# EAGLE design GPSN v1 (EAGLE 9.5.0)
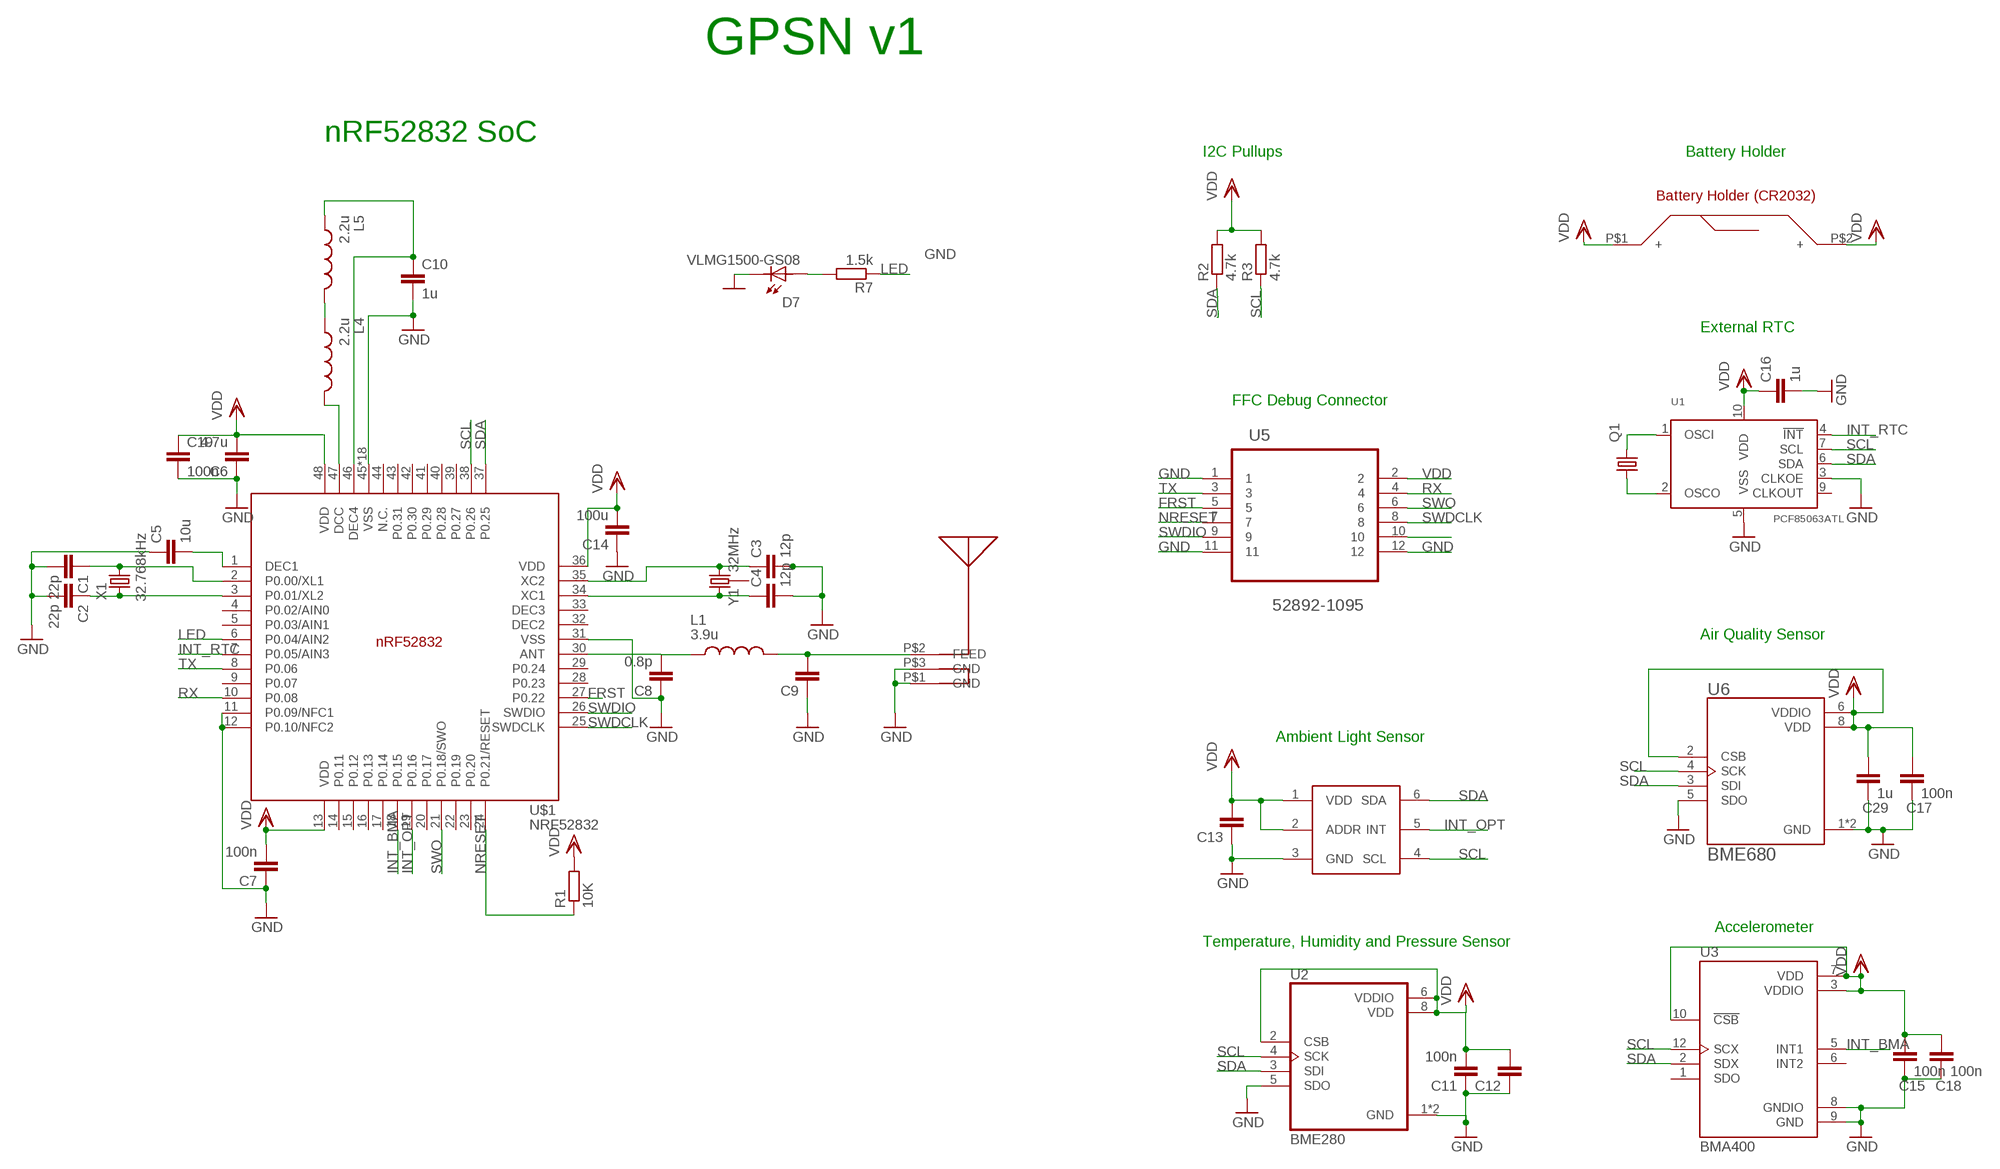
[diagram p0: schematic, sheet 1]

## Parts
C1  22p  CC0402  [C0402]
C2  22p  CC0402  [C0402]
C3  12p  CC0402  [C0402]
C4  12p  CC0402  [C0402]
C5  10u  CC0402  [C0402]
C6  4.7u  CC0402  [C0402]
C7  100n  CC0603R  [C0603R]
C8  0.8p  CC0402  [C0402]
C9  1.2p  CC0402  [C0402]
C10  1u  CC0402  [C0402]
C11  100n  CC0402  [C0402]
C12  1u  CC0402  [C0402]
C13  100n  CC0402  [C0402]
C14  100u  CC0402  [C0402]
C15  100n  CC0402  [C0402]
C16  1u  CC0603R  [C0603R]
C17  100n  CC0402  [C0402]
C18  100n  CC0402  [C0402]
C19  100n  CC0402  [C0402]
C29  1u  CC0402  [C0402]
D7  VLMG1500-GS08  [LEDC1005X35N]
L1  3.9u  MHQ0402P7N5JT000  [INDC0402X26N]
L4  2.2u  MHQ0402P7N5JT000  [INDC0402X26N]
L5  2.2u  MHQ0402P7N5JT000  [INDC0402X26N]
Q1  KX-327-RT  [2.0X1.2]
R1  10K  RR0402  [R0402]
R2  4.7k  RR0402  [R0402]
R3  4.7k  RR0402  [R0402]
R7  1.5k  RR0402  [R0402]
U1  PCF85063ATL  [SOT1197-1]
U2  BME280  [PSON65P250X250X100-8N]
U3  BMA400  [XDCR_BMA400]
U5  52892-1095  [MOLEX_52892-1095]
U6  BME680  [PSON80P300X300X100-8N]
U$1  NRF52832  [QFN40P600X600X90-48_N]
U$2  HOLDER  [HOLDER]
U$3  TI-OPT3001  [TI-OPT3001]
U$4  CHIPANTENNAL2  [CHIPANTENNAL2]
X1  32.768kHz  ABS07-32.768KHZ-T  [ABS07-32.768KHZ-T]
Y1  32MHz  CRYSTAL-26MHZSMD-3.2X2.5  [CRYSTAL-SMD-3.2X2.5MM]

## Nets
FRST: U5.5 U$1.27(P0.22)
GND: C1.2 C2.2 C3.2 C4.2 C5.1 C6.1 C7.1 C8.1 C9.1 C10.2 C11.1 C12.1 C13.1 C14.1 C15.2 C16.2 C17.2 C18.2 C19.2 C29.2 D7.2 U1.3(CLKOE) U1.5(VSS) U2.1(GND) U2.5(SDO) U2.7(GND) U3.8(GNDIO) U3.9(GND) U5.1 U5.11 U5.12 U6.1(GND) U6.5(SDO) U6.7(GND) U$1.11(P0.09/NFC1) U$1.12(P0.10/NFC2) U$1.31(VSS) U$1.45(VSS) U$1.PAD(VSS) U$1.PAD@VIA01(VSS) U$1.PAD@VIA02(VSS) U$1.PAD@VIA03(VSS) U$1.PAD@VIA04(VSS) U$1.PAD@VIA05(VSS) U$1.PAD@VIA06(VSS) U$1.PAD@VIA07(VSS) U$1.PAD@VIA08(VSS) U$1.PAD@VIA09(VSS) U$1.PAD@VIA10(VSS) U$1.PAD@VIA11(VSS) U$1.PAD@VIA12(VSS) U$1.PAD@VIA13(VSS) U$1.PAD@VIA14(VSS) U$1.PAD@VIA15(VSS) U$1.PAD@VIA16(VSS) U$3.3(GND) U$4.P$1(GND) U$4.P$3(GND)
INT_BMA: U3.5(INT1) U$1.18(P0.15)
INT_OPT: U$1.19(P0.16) U$3.5(INT)
INT_RTC: U1.4(!INT!) U$1.7(P0.05/AIN3)
LED: R7.1 U$1.6(P0.04/AIN2)
N$1: C1.1 U$1.2(P0.00/XL1) X1.2
N$2: C2.1 U$1.3(P0.01/XL2) X1.1
N$3: C3.1 U$1.35(XC2) Y1.3
N$4: C4.1 U$1.34(XC1) Y1.1
N$5: C5.2 U$1.1(DEC1)
N$6: C8.2 L1.1 U$1.30(ANT)
N$7: Q1.2 U1.1(OSCI)
N$8: Q1.1 U1.2(OSCO)
N$9: L4.2 U$1.47(DCC)
N$10: L4.1 L5.2
N$11: C10.1 L5.1 U$1.46(DEC4)
N$19: D7.1 R7.2
N$21: U5.10
NRESET: R1.1 U5.7 U$1.24(P0.21/RESET)
RF: C9.2 L1.2 U$4.P$2(FEED)
RX: U5.4 U$1.10(P0.08)
SCL: R3.1 U1.7(SCL) U2.4(SCK) U3.12(SCX) U6.4(SCK) U$1.38(P0.26) U$3.4(SCL)
SDA: R2.1 U1.6(SDA) U2.3(SDI) U3.2(SDX) U6.3(SDI) U$1.37(P0.25) U$3.6(SDA)
SWDCLK: U5.8 U$1.25(SWDCLK)
SWDIO: U5.9 U$1.26(SWDIO)
SWO: U5.6 U$1.21(P0.18/SWO)
TX: U5.3 U$1.8(P0.06)
VDD: C6.2 C7.2 C11.2 C12.2 C13.2 C14.2 C15.1 C16.1 C17.1 C18.1 C19.1 C29.1 R1.2 R2.2 R3.2 U1.10(VDD) U2.2(CSB) U2.6(VDDIO) U2.8(VDD) U3.3(VDDIO) U3.7(VDD) U3.10(!CSB) U5.2 U6.2(CSB) U6.6(VDDIO) U6.8(VDD) U$1.13(VDD) U$1.36(VDD) U$1.48(VDD) U$2.P$1(+) U$2.P$2(+) U$3.1(VDD) U$3.2(ADDR)
Unconnected: U1.9(CLKOUT) U3.1(SDO) U3.6(INT2) U$1.4(P0.02/AIN0) U$1.5(P0.03/AIN1) U$1.9(P0.07) U$1.14(P0.11) U$1.15(P0.12) U$1.16(P0.13) U$1.17(P0.14) U$1.20(P0.17) U$1.22(P0.19) U$1.23(P0.20) U$1.28(P0.23) U$1.29(P0.24) U$1.32(DEC2) U$1.33(DEC3) U$1.39(P0.27) U$1.40(P0.28) U$1.41(P0.29) U$1.42(P0.30) U$1.43(P0.31) U$1.44(N.C.) Y1.2 Y1.4

## Notes on the sheet
- GPSN v1
- nRF52832 SoC
- I2C Pullups | Battery Holder
- External RTC
- FFC Debug Connector
- Air Quality Sensor
- Ambient Light Sensor
- Accelerometer
- Temperature, Humidity and Pressure Sensor

## Library data of the parts
C1-C6 C8-C15 C17-C19 C29 = eagle-ltspice:C: CAPACITOR, European symbol; SPICEMODEL: NONE; SPICEPREFIX: C
C7 C16 = eagle-ltspice:C: CAPACITOR, European symbol
D7 = VLMG1500-GS08:VLMG1500-GS08: 0402 GREEN 571nm 35MCD 65° Rectangle with Flat Top SMT LED; AVAILABILITY: Unavailable; DESCRIPTION: 0402 GREEN 571nm 35MCD 65° Rectangle with Flat Top SMT LED; MF: Vishay; MP: VLMG1500-GS08; PACKAGE: 0402 Vishay; PRICE: None
L1 L4 L5 = MHQ0402P7N5JT000:MHQ0402P7N5JT000: 221 NH 5% GOLD TERMINAL; AVAILABILITY: Unavailable; DESCRIPTION: FIXED IND 7.5NH 200MA 1.2 OHM; MF: TDK; MP: MHQ0402P7N5JT000; PACKAGE: 0402 TDK; PRICE: None
Q1 = crystal-geyer_V1_0:KX-327: Tuning Fork Crystals (kHz) SMD: KX327 - Serie Model Size l/w/h [mm] Frequency Range Frequency Stability Temp. Range [°C] Load Capacitance AECQ 200 availabel Datasheet KX-327VT KX-327FT KX-327RT KX-327NHT KX-327NHF KX-327L KX-327S 1.25/1.05/0.5 1.6/1.0/0.5 2.0/1.2/0.6 3.2/1.5/0.8 3.2/1.5/0.8 7.0/1.5/1.4 8.2/3.8/2.5 32,768 kHz 32,768 kHz 32,768 kHz 32,768 kHz 32,768 kHz 32,768 kHz 32,768 kHz ±10 … ±20ppm ±10 … ±20ppm ±10 … ±20ppm ±10 … ±20ppm ±10 … ±20ppm ±10 … ±20ppm ±5 … ±20ppm (*) -40°C …+85°C (*) -40°C …+85°C (*) -40°C …+85°C (*) -40°C …+85°C (*) -40°C …+125°C (*) -40°C …+85°C (*) -40°C …+85°C 7/9/12,5 7/9/12,5 7/9/12,6 7/9/12,5 9/12,5 7/9/12,5 6/12,5 - - - - yes - - KX-327VT.pdf <http://www.geyer-electronic.de/uploads/tx_userartikelfrequenz/GEYER-KX-327VT.pdf> KX-327FT.pdf <http://www.geyer-electronic.de/uploads/tx_userartikelfrequenz/GEYER-KX-327FT.pdf> KX-327RT.pdf <http://www.geyer-electronic.de/uploads/tx_userartikelfrequenz/GEYER-KX-327RT.pdf> KX-327NHT.pdf <http://www.geyer-electronic.de/uploads/tx_userartikelfrequenz/GEYER-KX-327NHT.pdf> KX-327NHF.pdf <http://www.geyer-electronic.de/uploads/tx_userartikelfrequenz/GEYER-KX-327NHF.pdf> KX-327L.pdf <http://www.geyer-electronic.de/uploads/tx_userartikelfrequenz/GEYER-KX-327L.pdf> KX-327S.pdf <http://www.geyer-electronic.de/uploads/tx_userartikelfrequenz/GEYER-KX-327S.pdf> <http://www.geyer-electronic.de/fileadmin/template/img/logo-geyer-electronic.png> Details see: http://www.geyer-electronic.de/Frequenz-Produkte.9.0.html Created 2016-06-07, Hans Locher 2016 (C) Geyer Quartz Technology KX327VT,KX327FT,KX327RT,KX327NHT,KX327NHF,KX327S,KX327L;125105;1610;2012;3215;7015;8238;1,25x1,05,1.25x1.05;1,6x1,0,1.6x1.0;2,0x1,2,2.0x1.2;3,2x1,5,3.2x1.5;8,2x3,8,8.2x3.8,7.0x1.5,7,0x1,532.768kHz
R1-R3 R7 = eagle-ltspice:R: RESISTOR, European symbol; SPICEMODEL: NONE; SPICEPREFIX: R
U1 = PCF85063ATL:PCF85063ATL: Tiny Real-Time Clock/calendar with alarm function and I2C-bus The PCF85063A is a CMOS1 Real-Time Clock (RTC) and calendar optimized for low power consumption. An offset register allows fine-tuning of the clock. All addresses and data are transferred serially via the two-line bidirectional I2C-bus. Maximum data rate is 400 kbit/s. The register address is incremented automatically after each written or read data byte. AAL Eindhoven MK; AVAILABILITY: Unavailable; DESCRIPTION: Real Time Clock _RTC_ IC Clock/Calendar I²C, 2-Wire Serial 10-XFDFN Exposed Pad; MF: NXP USA; MP: PCF85063ATL; PACKAGE: DFN-10 NXP Semiconductors; PRICE: None
U2 = BME280:BME280: DIGITAL HUMIDITY, PRESSURE AND TEMPERATURE SENSOR * Digital interface I²C (up to 3.4 MHz) and SPI (3 and 4 wire, up to 10 MHz)* Supply voltage VDD main supply voltage range: 1.71 V to 3.6 V*VDDIO interface voltage range: 1.2 V to 3.6 V Operating range -40…+85 °C, 0…100 % rel. humidity, 300…1100 hPa The library has been designed by Richard Magdycz <https://www.facebook.com/groups/eaglecadsoftUK>; AVAILABILITY: Unavailable; DESCRIPTION: Integrated pressure, humidity and temperature sensor; 8-pin 2.5x2.5x0.93mm LGA; MF: Bosch; MP: BME280; PACKAGE: LGA-8 Bosch; PRICE: None
U3 = BMA400:BMA400: Ultra low power, 12-bit digital triaxial accelerometer; AVAILABILITY: Unavailable; DESCRIPTION: Accelerometer X, Y, Z Axis ±2g, 4g, 8g, 16g 12-LGA _2x2_; MF: Bosch Sensortec; MP: BMA400; PACKAGE: LGA-12 Bosch Tools; PRICE: None
U5 = 52892-1095:52892-1095: CONNECTOR, FPC, ZIF, 0.50MM, 10 WAY; AVAILABILITY: Unavailable; DESCRIPTION: Socket, r/a, Fpc, Zif, Smt, 10way; MF: Molex; MP: 52892-1095; PACKAGE: None; PRICE: None
U6 = BME680:BME680: Integrated Environmental Unit; AVAILABILITY: Unavailable; DESCRIPTION: Integrated Environmental Unit; MF: Bosch Sensortec; MP: BME680; PACKAGE: LGA-8 Bosch Tools; PRICE: None
U$1 = Nordic_nRF:NRF52832: nRF52832 Features Single chip, highly flexible, 2.4 GHz multi-protocol SoC 32-bit ARM Cortex-M4F Processor 1.7v to 3.6v operation 512kB flash + 64kB RAM Supports concurrent Bluetooth Smart/ANT protocol operation On-chip NFC tag for Out-of-Band (OOB) pairing Up to +4dBm output power -96dBm sensitivity, Bluetooth Smart Thread safe and run-time protected Event driven API On air compatible with nRF24L and nRF24AP series 2 data rates (2Mbps/1Mbps) PPI - maximum flexibility for power-efficient applications and code simplification Automated power management system with automatic power management of each peripheral Configurable I/O mapping for analog and digital I/O 3 x Master/Slave SPI 2 x Two-wire interface (I²C) UART (RTS/CTS) 3 x PWM AES HW encryption Real Time Counter (RTC) Digital microphone interface (PDM) On-chip balun Applications Internet of Things (IoT) Wearables SmartHome sensors Connected white goods Computer peripherals Voice-command smart remotes A4WP ‘Rezence’ wireless charging Beacons Sports and fitness sensors and hubs Connected health products Smart watches RC Toys Interactive games Building automation and sensor networks
U$2 = batt holder:HOLDER
U$3 = FaBo-Mems:TI-OPT3001
U$4 = CHIPANTENNA:CHIPANTENNAL2
X1 = Crystals:ABS07-32.768KHZ-T: CRYSTAL 32.7680KHZ 12.5PF SMD Manufacturer's datasheet <https://abracon.com/Resonators/ABS07.pdf>; CREATED_BY: PCBLayout.com; DIGIKEY_PART_NUMBER: 535-9542-2-ND; MANUFACTURER: Abracon LLC; MPN: ABS07-32.768KHZ-T; PACKAGE: SMD-2
Y1 = SparkFun-Clocks:CRYSTAL-26MHZ: 26MHz Crystal w/ Ground Pin Digikey Example <http://www.digikey.com/product-detail/en/epson/TSX-3225%2026.0000MF09Z-AC3/SER3627CT-ND/1802878> Frequency: 26MHz Frequency Stability: ±9ppm Frequency Tolerance: ±10ppm Load Capacitance: 9pF SparkFun Products: SparkFun ESP32 Thing <https://www.sparkfun.com/products/13907> SparkFun ESP8266 Thing Dev Board <https://www.sparkfun.com/products/13711>; PROD_ID: XTAL-12454

## Net classes
1 RF: clearance 0.4 mm

## Board
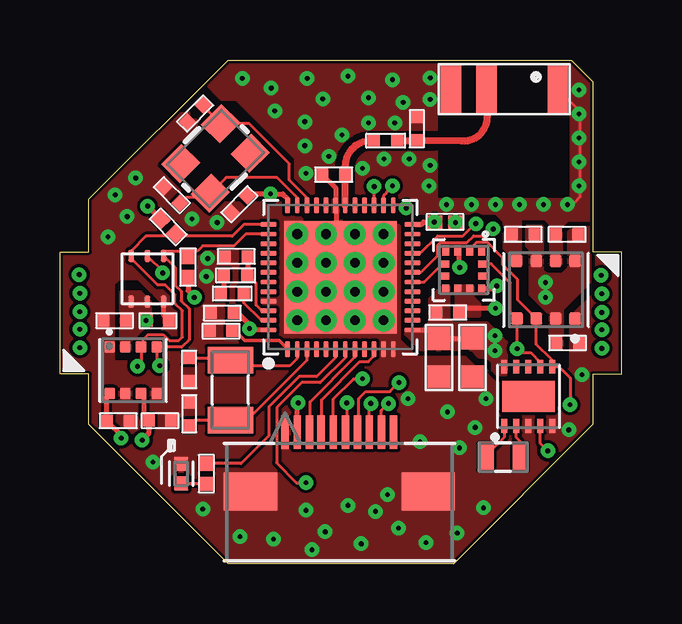
[diagram p1: board, top side]
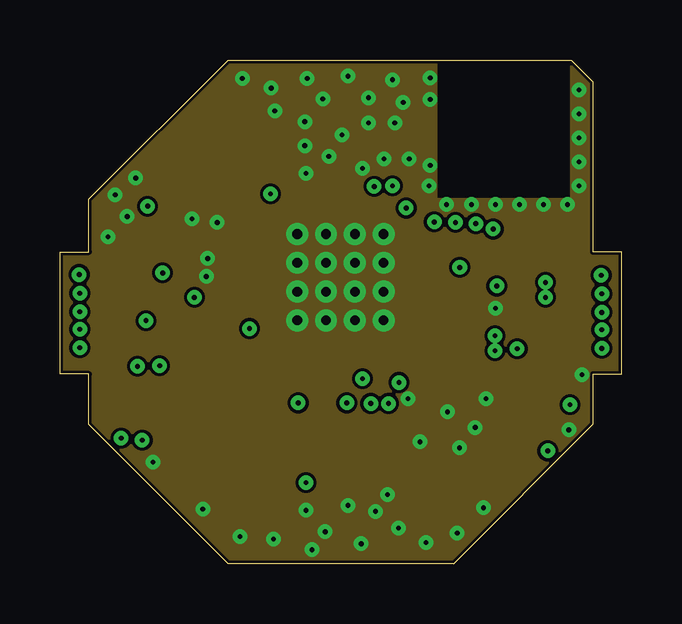
[diagram p2: board, inner layer GND]
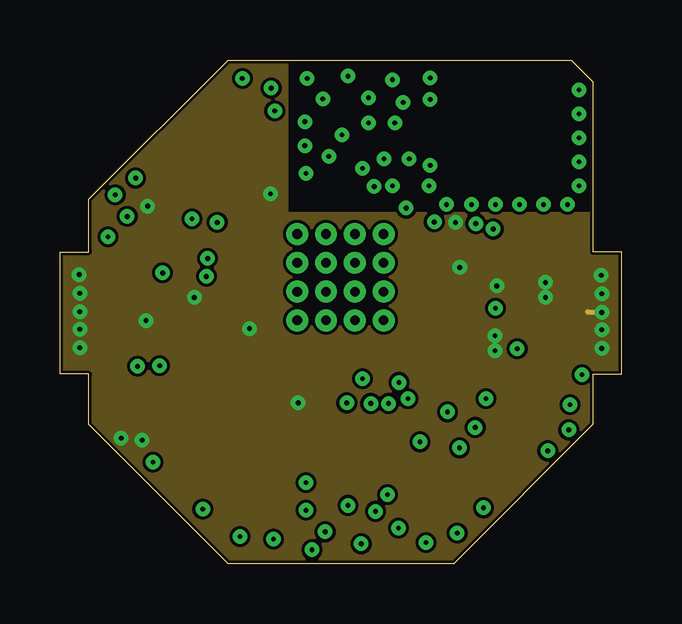
[diagram p3: board, inner layer VDD]
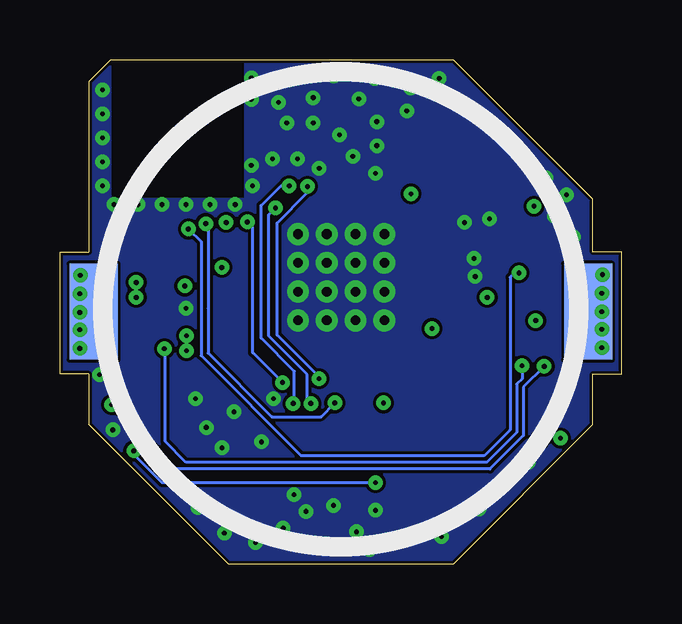
[diagram p4: board, bottom side, seen from below]

Size 23.4 x 21 mm. Coordinates in mm from the lower left corner, seen from the top.
Outline: 1.2,5.8 1.2,7.9 0,7.9 0,13 1.2,13 1.2,15.2 7,21 21.3,21 22.2,20.1 22.2,13 23.4,13 23.4,7.9 22.2,7.9 22.2,5.8 16.4,0 7,0 1.2,5.8
Copper layers (1+2*15+16): Top 0.035mm / dielectric 0.2mm / GND 0.0175mm / dielectric 0.465mm / VDD 0.0175mm / dielectric 0.2mm / Bottom 0.035mm
Design rules "default *": minimum track width 5mil, minimum drill 0.2mm, track to track 5mil, track to pad 5mil, pad to pad 5mil, via to via 5mil, smd to smd 5mil, copper to edge 5mil, drill to drill 6mil, minimum pad ring 10mil, minimum via ring 8mil, stop-mask expansion 0mil, vias tented up to drill 40mil, thermal gap 0mil
tRestrict: area 11.6,15.2 to 11.8,15.8; area 10.6,15.2 to 12,16.6; 7 lines

### Footprints (pad centres in the part's own frame; a part is rotated, then mirrored left to right if it is on the bottom)
C0402 = smd 0.5 x 0.5: 1 -0.475,0; 2 0.475,0
C0603R = smd 0.95 x 0.95: 1 -0.85,0; 2 0.75,0
LEDC1005X35N = smd 0.59 x 0.61: 1 -0.415,0; 2 0.415,0
INDC0402X26N = smd 0.5 x 0.5: 1 -0.732,0; 2 0.232,0
2.0X1.2 = smd 0.6 x 1.1: 1 -0.7,0; 2 0.7,0
R0402 = smd 0.6 x 0.55: 1 -0.425,0; 2 0.425,0
SOT1197-1 = smd 0.25 x 0.575: 1 -1,-1.238; 2 -0.5,-1.238; 3 0,-1.238; 4 0.5,-1.238; 5 1,-1.238; 6 1,1.238; 7 0.5,1.238; 8 0,1.238; 9 -0.5,1.238; 10 -1,1.238 | smd 2.2 x 1.3: CP 0,0
PSON65P250X250X100-8N = smd 0.49 x 0.45: 1 0.97,0.975; 2 0.97,0.325; 3 0.97,-0.325; 4 0.97,-0.975; 5 -0.97,-0.975; 6 -0.97,-0.325; 7 -0.97,0.325; 8 -0.97,0.975
XDCR_BMA400 = smd 0.35 x 0.3: 1 -0.775,0.75; 2 -0.775,0.25; 3 -0.775,-0.25; 4 -0.775,-0.75; 7 0.775,-0.75; 8 0.775,-0.25; 9 0.775,0.25; 10 0.775,0.75 | smd 0.3 x 0.35: 5 -0.25,-0.775; 6 0.25,-0.775; 11 0.25,0.775; 12 -0.25,0.775
MOLEX_52892-1095 = smd 0.305 x 1.397: 1 2.261,2.896; 2 1.753,2.896; 3 1.245,2.896; 4 0.762,2.896; 5 0.254,2.896; 6 -0.254,2.896; 7 -0.762,2.896; 8 -1.245,2.896; 9 -1.753,2.896; 10 -2.261,2.896 | smd 2.21 x 1.6: 11 -3.702,5.359; 12 3.702,5.359
PSON80P300X300X100-8N = smd 0.5 x 0.5: 1 1.2,1.2; 2 1.2,0.4; 3 1.2,-0.4; 4 1.2,-1.2; 5 -1.2,-1.22; 6 -1.2,-0.4; 7 -1.2,0.4; 8 -1.2,1.2
QFN40P600X600X90-48_N = smd 0.65 x 0.2: 1 -3,2.2; 2 -3,1.8; 3 -3,1.4; 4 -3,1; 5 -3,0.6; 6 -3,0.2; 7 -3,-0.2; 8 -3,-0.6; 9 -3,-1; 10 -3,-1.4; 11 -3,-1.8; 12 -3,-2.2; 25 3,-2.2; 26 3,-1.8; 27 3,-1.4; 28 3,-1; 29 3,-0.6; 30 3,-0.2; 31 3,0.2; 32 3,0.6; 33 3,1; 34 3,1.4; 35 3,1.8; 36 3,2.2 | smd 0.2 x 0.65: 13 -2.2,-3; 14 -1.8,-3; 15 -1.4,-3; 16 -1,-3; 17 -0.6,-3; 18 -0.2,-3; 19 0.2,-3; 20 0.6,-3; 21 1,-3; 22 1.4,-3; 23 1.8,-3; 24 2.2,-3; 37 2.2,3; 38 1.8,3; 39 1.4,3; 40 1,3; 41 0.6,3; 42 0.2,3; 43 -0.2,3; 44 -0.6,3; 45 -1,3; 46 -1.4,3; 47 -1.8,3; 48 -2.2,3 | smd 4.7 x 4.7: PAD 0,0 | drill 0.4: PAD@VIA01 -1.8,1.8; PAD@VIA02 -1.8,0.6; PAD@VIA03 -1.8,-0.6; PAD@VIA04 -1.8,-1.8; PAD@VIA05 -0.6,1.8; PAD@VIA06 -0.6,0.6; PAD@VIA07 -0.6,-0.6; PAD@VIA08 -0.6,-1.8; PAD@VIA09 0.6,1.8; PAD@VIA10 0.6,0.6; PAD@VIA11 0.6,-0.6; PAD@VIA12 0.6,-1.8; PAD@VIA13 1.8,1.8; PAD@VIA14 1.8,0.6; PAD@VIA15 1.8,-0.6; PAD@VIA16 1.8,-1.8
HOLDER = smd 2 x 4: P$1 10.3,-0.1; P$2 -10.3,-0.1
TI-OPT3001 = smd 0.5 x 0.25: 1 -0.95,0.675; 2 -0.95,0; 3 -0.95,-0.675; 4 0.95,-0.675; 5 0.95,0; 6 0.95,0.675
CHIPANTENNAL2 = smd 0.85 x 2: P$1 0.45,1; P$2 1.925,1; P$3 4.9,1
ABS07-32.768KHZ-T = smd 1.1 x 1.9: 1 -1.25,0; 2 1.25,0
CRYSTAL-SMD-3.2X2.5MM = smd 1.2 x 1.1: 1 -1.175,-0.875; 2 1.175,-0.875; 3 1.175,0.875; 4 -1.175,0.875

### Placement (x,y rotation side)
C1  5.38,8.09 270 top
C2  5.38,6.25 90 top
C3  4.66,15.36 135 top
C4  5.63,18.77 225 top
C5  6.71,9.69 0 top
C6  2.42,5.96 180 top
C7  15.79,8.64 90 top
C8  11.41,16.22 0 top
C9  14.87,18.13 270 top
C10  7.34,12.8 180 top
C11  4.17,5.96 180 top
C12  7.48,14.98 45 top
C13  6.76,10.45 0 top
C14  4.08,10.13 180 top
C15  16.15,10.47 0 top
C16  17.18,8.54 270 top
C17  19.3,13.72 180 top
C18  21.15,9.2 0 top
C19  21.12,13.72 180 top
C29  2.28,10.13 180 top
D7  5.05,3.75 90 top
L1  13.81,17.64 0 top
L4  7.42,11.26 0 top
L5  7.07,12.02 180 top
Q1  18.46,4.44 180 top
R1  16.04,14.24 0 top
R2  4.51,14.04 135 top
R3  5.33,12.36 270 top
R7  6.1,3.75 270 top
U1  19.52,6.97 0 top
U2  3.05,8.06 90 top
U3  16.82,12.24 270 top
U5  11.64,8.37 180 top
U6  20.25,11.41 270 top
U$1  11.68,11.94 90 top
U$2  11.7,10.61 0 bottom
U$3  3.64,11.88 90 top
U$4  15.84,18.78 0 top
X1  7.1,7.24 90 top
Y1  6.48,16.89 225 top

### Tracks (layer width: path | path; a pad name or v marks a point on that pad's centre or on a via)
FRST  (via drill 0.2)
  Top 0.127: U$1.27 v13.08,15.72 v13.09,15.72 | U5.5 11.39,6.86 12.23,7.71 v12.61,7.71
  Bottom 0.127: v12.61,7.71 12.61,7.78 14.35,9.53 14.35,14.2 13.09,15.46 v13.09,15.72
GND  (via drill 0.2)
  Top 0.127: U$4.P$3 21.65,18.87 21.65,15.28 21.38,15
  Top 0.2: U$3.3 4.32,10.37 C14.1 4.41,9.99 | U$1.PAD@VIA14 11.42,13.4 11.5,13.4 11.5,14.93 U$1.31 11.48,15.67 C8.1 | C15.2 16.81,10.65 v18.15,10.65
  other vias: 16.1,14.97 17.15,14.97 18.15,14.97 19.15,14.97 20.15,14.97 21.15,14.97 15.38,15.75 15.43,16.6 15.43,20.25 15.43,19.35 21.62,15.75 21.62,16.75 21.62,17.75 21.62,18.75 21.62,19.75 13.5,16.88 14.55,16.88 12.6,16.48 13.95,18.38 14.3,19.23 11.2,16.98 11.75,17.88 12.85,18.38 10.25,16.27 12.85,19.43 7.5,1.12 3.88,4.22 5.95,2.27 13.65,2.88 10.5,0.57 12,2.42 8.9,1.02 10.25,2.23 16.55,1.27 13.15,2.17 10.2,17.43 2.8,14.47 10.3,20.23 21.75,7.88 21.2,5.58 17.65,2.33 12.55,0.82 14.1,1.48 11.05,1.32 15.25,0.88 3.15,16.07 2,13.62 17.3,5.67 16.15,6.33 16.65,4.83 10.2,18.43 8.95,18.88 7.6,20.23 17.75,6.88 15,5.08 10.95,19.38 12,20.32 8.8,19.82 13.85,20.18 14.5,6.88 2.3,15.38 6.15,12.72 6.1,11.97 5.5,14.38 6.55,14.22
  pour GND: 1.2,15.18 7,20.98 15.65,20.98 15.65,15.2 22.2,15.2 22.2,13 23.4,13 23.4,7.9 22.2,7.9 22.2,5.83 16.38,0 7,0 1.2,5.8 1.2,7.9 0,7.9 0,13 1.2,13
  pour Top: 15.57,14.65 10.9,14.65 10.47,15.07 10.47,15.4 9.82,16.05 9.82,16.88 7.35,19.35 6.73,19.35 6.05,20.02 7,20.98 15.68,20.98 15.68,14.75
  pour Top: 1.15,15.18 2.88,16.9 3.65,16.9 6,14.55 6.3,14.55 6.8,15.05 9.4,15.05 10.17,14.28 13.95,14.28 14.12,14.1 14.12,9.35 14.85,8.62 16.88,8.62 17.27,8.22 17.62,8.22 17.75,8.1 17.75,7.92 18.12,7.55 22.2,7.55 22.2,5.85 16.4,0.05 6.9,0.05 1.2,5.75 1.2,7.4 2.22,8.43 2.88,8.43 4.33,9.88 4.33,10.8 3.25,11.88 2.33,11.88 1.2,13 1.2,13.05 1.15,13.1
  pour Top: 1.2,7.5 1.2,7.88 0.05,7.88 0.02,7.9 0.02,12.97 1.45,12.97 2.38,12.05 2.38,11.8 2.22,11.65 2.22,8.32 1.4,7.5
  pour Top: 20.57,7.55 21.22,8.2 21.22,9.25 21.22,10.3 21.32,10.4 22.3,11.38 22.3,12.5 22.3,12.97 23.4,12.97 23.4,7.92 23.35,7.88 22.2,7.88 22.2,7.53 20.6,7.53
  pour Top: 14.32,15.2 22.15,15.2 22.15,14.3 21.15,14.3 20.88,14.03 20.88,12.45 20.45,12.45 20.45,14.12 20.2,14.38 19.18,14.38 19.18,12.47 18.8,12.47 18.72,12.55 18.72,12.9 18.5,13.12 18.5,14.25 18.15,14.6 14.92,14.6
  pour Bottom: 1.25,15.2 7.05,21 15.68,21 15.68,15.18 22.25,15.18 22.25,13.03 23.45,13.03 23.45,7.92 22.25,7.92 22.25,5.85 16.43,0.03 7.05,0.03 1.25,5.83 1.25,7.92 0.05,7.92 0.05,13.03 1.25,13.03
  pour Top: 21.3,15.18 21.3,20.98 22.18,20.1 22.18,20.07 22.18,15.2 22.15,15.18
  pour Top: 21.07,18.82 21.4,18.82 21.4,20.75 21.07,20.75
  pour Top: 15.62,18.85 15.95,18.85 15.95,20.7 15.62,20.7
  pour GND: 21.32,15.25 21.32,20.95 22.1,20.18 22.1,15.28 22.07,15.25
  pour Bottom: 21.3,15.25 21.3,20.98 22.1,20.18 22.1,15.28 22.07,15.25
  pour Top: 3,16.9 4.85,18.75 5.35,18.75 5.7,18.4 5.7,18.35 4.05,16.7 3.25,16.7 3.2,16.7
  pour Top: 16.55,10.35 16.55,11.55 17.15,11.55 17.15,11.1 17.45,10.8 17.45,10.35
INT_BMA
  Top 0.127: U$1.18 15.18,11.74 15.93,12.49 U3.5
INT_OPT  (via drill 0.2)
  Top 0.127: U$3.5 4.28,12.19 v4.28,12.12 | U$1.19 14.69,12.15 15.05,12.15 15.73,12.84 15.73,13.27 15.85,13.39 16.95,13.39 17.23,13.66 17.77,13.66 v18.05,13.95
  Bottom 0.127: v4.28,12.12 4.48,12.12 4.65,11.94 4.65,5.58 5.73,4.5 13.35,4.5 17.52,8.68 17.52,13.43 v18.05,13.95
INT_RTC  (via drill 0.2)
  Top 0.127: U$1.7 11.9,8.93 11.9,8.6 10.84,7.55 10.07,7.55 9.04,6.51 9.04,5.56 9.02,5.55 9.02,4.2 9.85,3.38 v10.25,3.38 | v20.32,4.7 20.02,5 U1.4
  Bottom 0.127: v10.25,3.38 19.15,3.38 20.32,4.55 v20.32,4.7
LED
  Top 0.127: U$1.6 11.47,8.93 11.47,8.58 10.7,7.8 9.97,7.8 8.7,6.53 8.7,5.33 7.55,4.17 R7.1
N$1
  Top 0.127: U$1.2 9.88,8.55 9.57,8.25 7.33,8.25 X1.2 7.02,8.56 C1.1
N$2
  Top 0.127: U$1.3 10.29,8.48 7.79,5.99 X1.1 5.6,5.99 C2.1
N$3
  Top 0.127: U$1.35 9.88,15.27 9.05,16.1 6.92,16.1 Y1.3 6.09,15.27 5.24,15.27 C3.1
N$4
  Top 0.127: U$1.34 10.3,14.96 10.3,15.24 9.55,15.99 9.55,16.67 7.88,18.34 Y1.1 | Y1.1 6.68,18.34 | Y1.1 5.97,19.07
  Top 0.2: 5.97,19.07 C4.1
N$5
  Top 0.152: C5.2 7.29,9.69 7.69,9.29 9.13,9.29 U$1.1
N$6
  Top 0.127: L1.1 13.07,17.62 12.92,17.62
  Top 0.2: C8.2 U$1.30
  Top 0.293: U$1.30 11.88,16.57 arc-89 12.92,17.62
N$7
  Top 0.127: Q1.2 17.77,4.51 18.52,5.26 U1.1
N$8
  Top 0.127: Q1.1 19.16,5.11 19.02,5.25 U1.2
N$9
  Top 0.127: U$1.47 8.38,10.15 7.66,10.87 L4.2
N$10
  Top 0.2: L5.2 6.83,11.4 L4.1
N$11
  Top 0.127: U$1.46 8.65,10.54 8.64,10.55 8.4,10.55 8.17,10.78 8.17,11.69 7.82,12.04
  Top 0.2: L5.1 7.82,12.04 C10.1 | U$1.46
N$19
  Top 0.127: D7.1 R7.2
NRESET  (via drill 0.2)
  Top 0.127: U5.7 12.4,5.83 12.46,5.88 12.46,6.88 12.75,7.17 13.74,7.17 v14.12,7.55 | 14.8,14.14 U$1.24 | R1.1 v15.59,14.24
  Top 0.2: 14.8,14.14 15.05,14.14 15.15,14.24 R1.1
  Bottom 0.127: v14.12,7.55 15.38,8.8 15.38,14.03 v15.59,14.24
RF
  Top 0.127: U$4.P$2 17.8,19.78 17.8,19.75 | 16.7,17.62
  Top 0.293: 16.7,17.62 L1.2 | L1.2 | 16.7,17.62 | 16.7,17.62 16.82,17.62 arc90 17.8,18.6 17.8,19.75 | L1.2 14.85,17.64 C9.2
RX
  Top 0.127: U5.4 10.9,5.5 10.9,6.83 12.5,8.43 12.85,8.43 13.08,8.66 U$1.10
SCL  (via drill 0.2)
  Top 0.127: v4.15,8.25 4.03,8.38 U2.4 4.43,9.03 5.07,9.03 5.38,9.33 5.38,10.63 5.04,10.96 5.04,11.36 4.8,11.6 4.8,12.34 U$3.4 4.32,13.04 5.08,13.04 | U1.7 20.02,8.39 19.61,8.8 19.2,8.8 v19.05,8.96 U6.4 18.77,10.5 18.77,11.7 17.98,12.49 U3.12 | 5.08,13.04 R3.1 | U$1.38 7.74,13.74 7.25,13.24 5.94,13.24 5.74,13.04 5.08,13.04
  Bottom 0.127: v4.15,8.25 4.15,7.7 4.37,7.48 4.37,5.46 5.61,4.22 18.15,4.22 19.02,5.09 19.02,8.93 v19.05,8.96
SDA  (via drill 0.2)
  Top 0.127: v3.23,8.22 3.38,8.38 U2.3 3.48,9.13 3.48,9.35 3.67,9.55 4.3,9.55 4.55,9.31 4.96,9.31 5.1,9.45 5.1,10.55 4.79,10.85 4.79,11.21 4.38,11.62 4.07,11.62 2.96,12.72 U$3.6 2.96,13.04 3.58,13.65 4.8,13.65 | v21.25,6.62 21.25,7.75 20.8,8.2 20.53,8.2 U1.6 20.48,8.25 20.48,8.5 19.85,9.14 U6.3 19.07,10.99 19.07,11.84 18.45,12.45 18.45,12.75 17.81,13.39 17.35,13.39 17.07,13.11 U3.2 | U$1.37 7.67,14.14 7.17,13.65 4.8,13.65 | R2.1 4.81,13.66 4.8,13.65
  Bottom 0.127: v21.25,6.62 18.57,3.94 5.49,3.94 4.09,5.34 4.09,7.36 v3.23,8.22
SWDCLK  (via drill 0.2)
  Top 0.127: U5.8 12.88,6.61 v12.95,6.67 | v14.42,14.82 14.31,14.94 U$1.25
  Bottom 0.127: v14.42,14.82 14.7,14.55 14.7,9.48 13.1,7.88 13.1,6.83 v12.95,6.67
SWDIO  (via drill 0.2)
  Top 0.127: U5.9 13.39,6.38 v13.68,6.67 | U$1.26 13.47,14.95 13.47,15.34 13.61,15.47 13.61,15.51 v13.85,15.75
  Bottom 0.127: v13.85,15.75 14.2,15.75 15.02,14.93 15.02,9.4 13.63,8.02 13.63,6.73 v13.68,6.67
SWO  (via drill 0.2)
  Top 0.127: U$1.21 14.69,12.95 15.01,12.95 15.73,13.66 16.78,13.66 17.29,14.18 v17.32,14.18 | v11.95,6.7 11.95,5.53 U5.6
  Bottom 0.127: v17.32,14.18 17.22,14.07 17.22,10.65 17.22,8.78 14.57,6.12 12.52,6.12 v11.95,6.7
TX
  Top 0.127: U5.3 10.42,5.5 10.42,6.75 12.29,8.61 U$1.8
VDD  (via drill 0.2)
  Top 0.127: R1.2 v16.47,14.22
  Top 0.2: 7.9,9.95 7.4,10.45 C13.2 | U$1.13 15.44,9.74 C7.2 C16.1 | U$1.36 9.48,15.21 9.28,15.42 v8.77,15.42 7.91,15.42 C12.2 | U2.8 1.95,6.96 C6.2 2.55,5.36 v2.55,5.22 | U2.6 3.5,6.96 3.5,6.16 C11.2 3.7,5.42 v3.42,5.15 | U5.2 9.89,6.66 v9.92,6.7 | U3.10 18.09,11.47 v18.2,11.57 | U$1.48 8.1,9.74 7.9,9.95 | v7.9,9.8 7.9,9.95 | R3.2 5.33,11.37 v5.6,11.1 | R2.2 v3.66,14.9 v3.65,14.9 | U3.3 16.61,12.99 16.61,12.4 v16.65,12.35
  VDD 0.2: v22.57,10.47 22,10.47 21.97,10.5
  Bottom 0.2: U$2.P$1 v0.82,10.5 | v22.57,10.47 22.54,10.51 U$2.P$2 22.57,11.08 v22.57,11.25
  other vias: 18.12,9.5 18.12,8.88 20.22,11.72 20.22,11.1 22.57,9.75 22.57,8.97 22.55,12.03 0.82,9 0.82,9.78 0.82,11.28 0.8,12.05 3.58,10.13
  pour Top: 17.15,8.9 15.05,8.9 14.4,9.55 arc0 14.4,9.8 15.12,9.8 15.4,10.07 15.4,11.05 15.93,11.57 16.18,11.57 16.2,11.55 16.2,10.2 16.35,10.05 17.8,10.05 18.6,9.25 18.6,7.88 18.2,7.88 18.02,8.05 18.02,8.38 17.8,8.6 17.45,8.6
  pour Top: 20.43,8.97 20.43,10.38 19.6,11.2 19.6,13.07 19.45,13.22 19.45,14.07 20.07,14.07 20.1,14.05 20.1,12.22 20.25,12.07 20.93,12.07 21.2,12.35 21.2,13.85 21.38,14.03 22.07,14.03 22.07,11.72 20.93,10.57 20.93,8.97
  pour VDD: 1.2,15.12 7.05,20.98 9.45,20.98 9.45,14.62 22.2,14.62 22.2,12.95 23.4,12.95 23.4,7.85 22.2,7.85 22.2,5.78 16.38,-0.05 7,-0.05 1.2,5.75 1.2,7.85 0,7.85 0,12.95 1.2,12.95
  pour Top: 2.53,8.85 2.53,11.32 2.55,11.35 3.35,11.35 3.75,10.95 3.75,9.97 3.65,9.97 2.92,9.25 2.92,8.85